# Altium schematic sheet ASIC_1.SchDoc: Title
size A2; Date: Date; CompanyName: Integrated Micro-Electronics Bulgaria; Organization: Design & Development Department; Address1: Drawing Type; Address2: Address 1; Address3: Address 2; Address4: Address 3; DocumentNumber: 730xxx; Revision: 01; SheetNumber: 1; SheetTotal: 1; PageSetup: Record=PageOptions|CenterHorizontal=True|CenterVertical=True|PrintScale=0.70|XCorrection=1.00|YCorrection=1.00|PrintKind=2|BorderSize=5000000|LeftOffset=0|BottomOffset=0|Orientation=2|PaperLength=1000|PaperWidth=1000|Scale=100|PaperSource=7|PrintQuality=-4|MediaType=1|DitherType=10|PaperKind=A4|PrintScaleMode=1; SheetSize: A3; Time: Time; ModifiedDate: Mod. Date
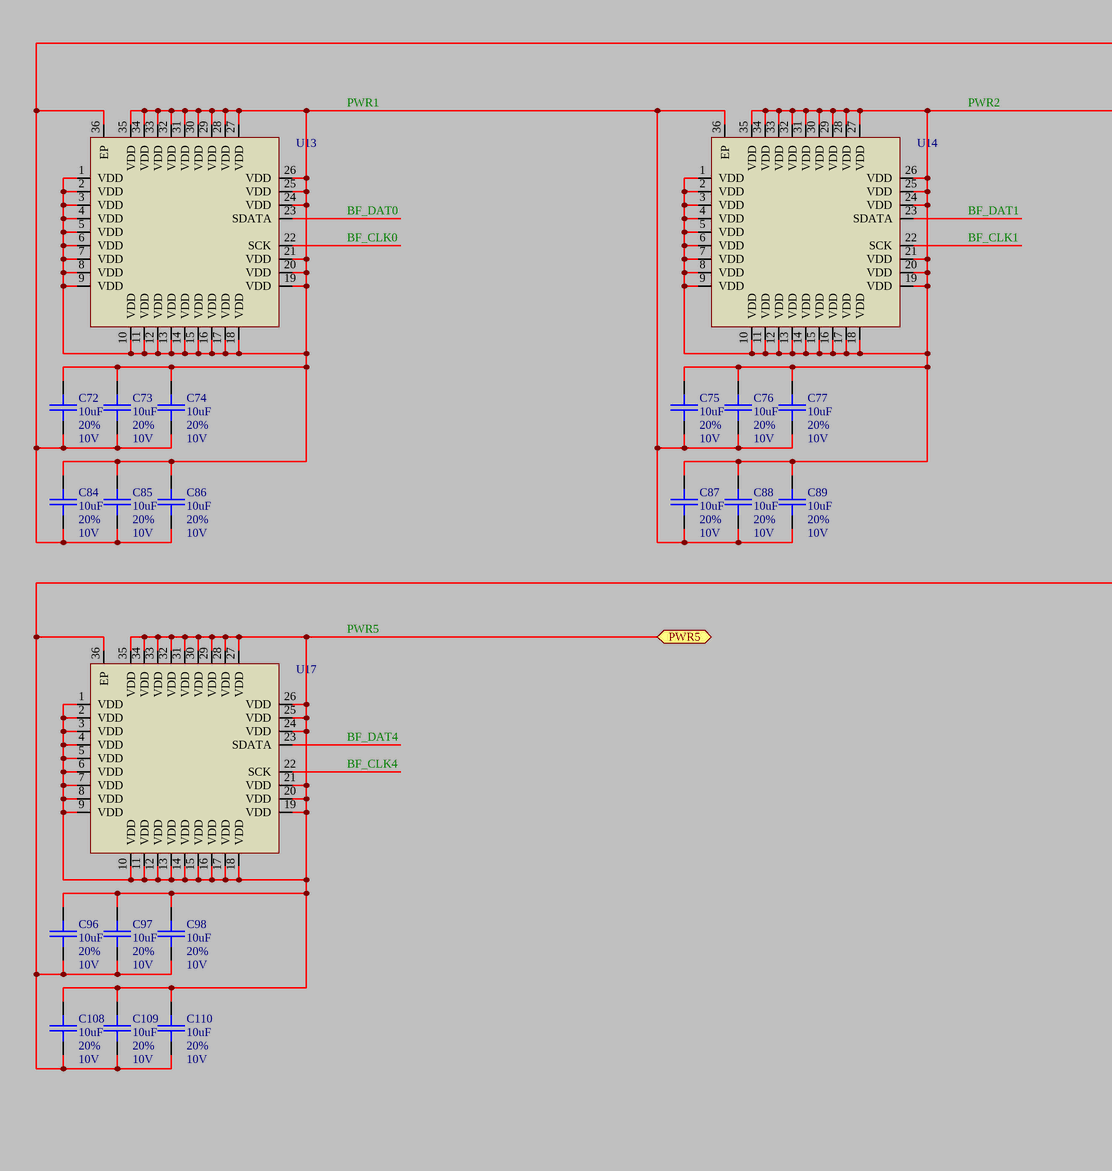
[diagram p0: ASIC_1.SchDoc, left]
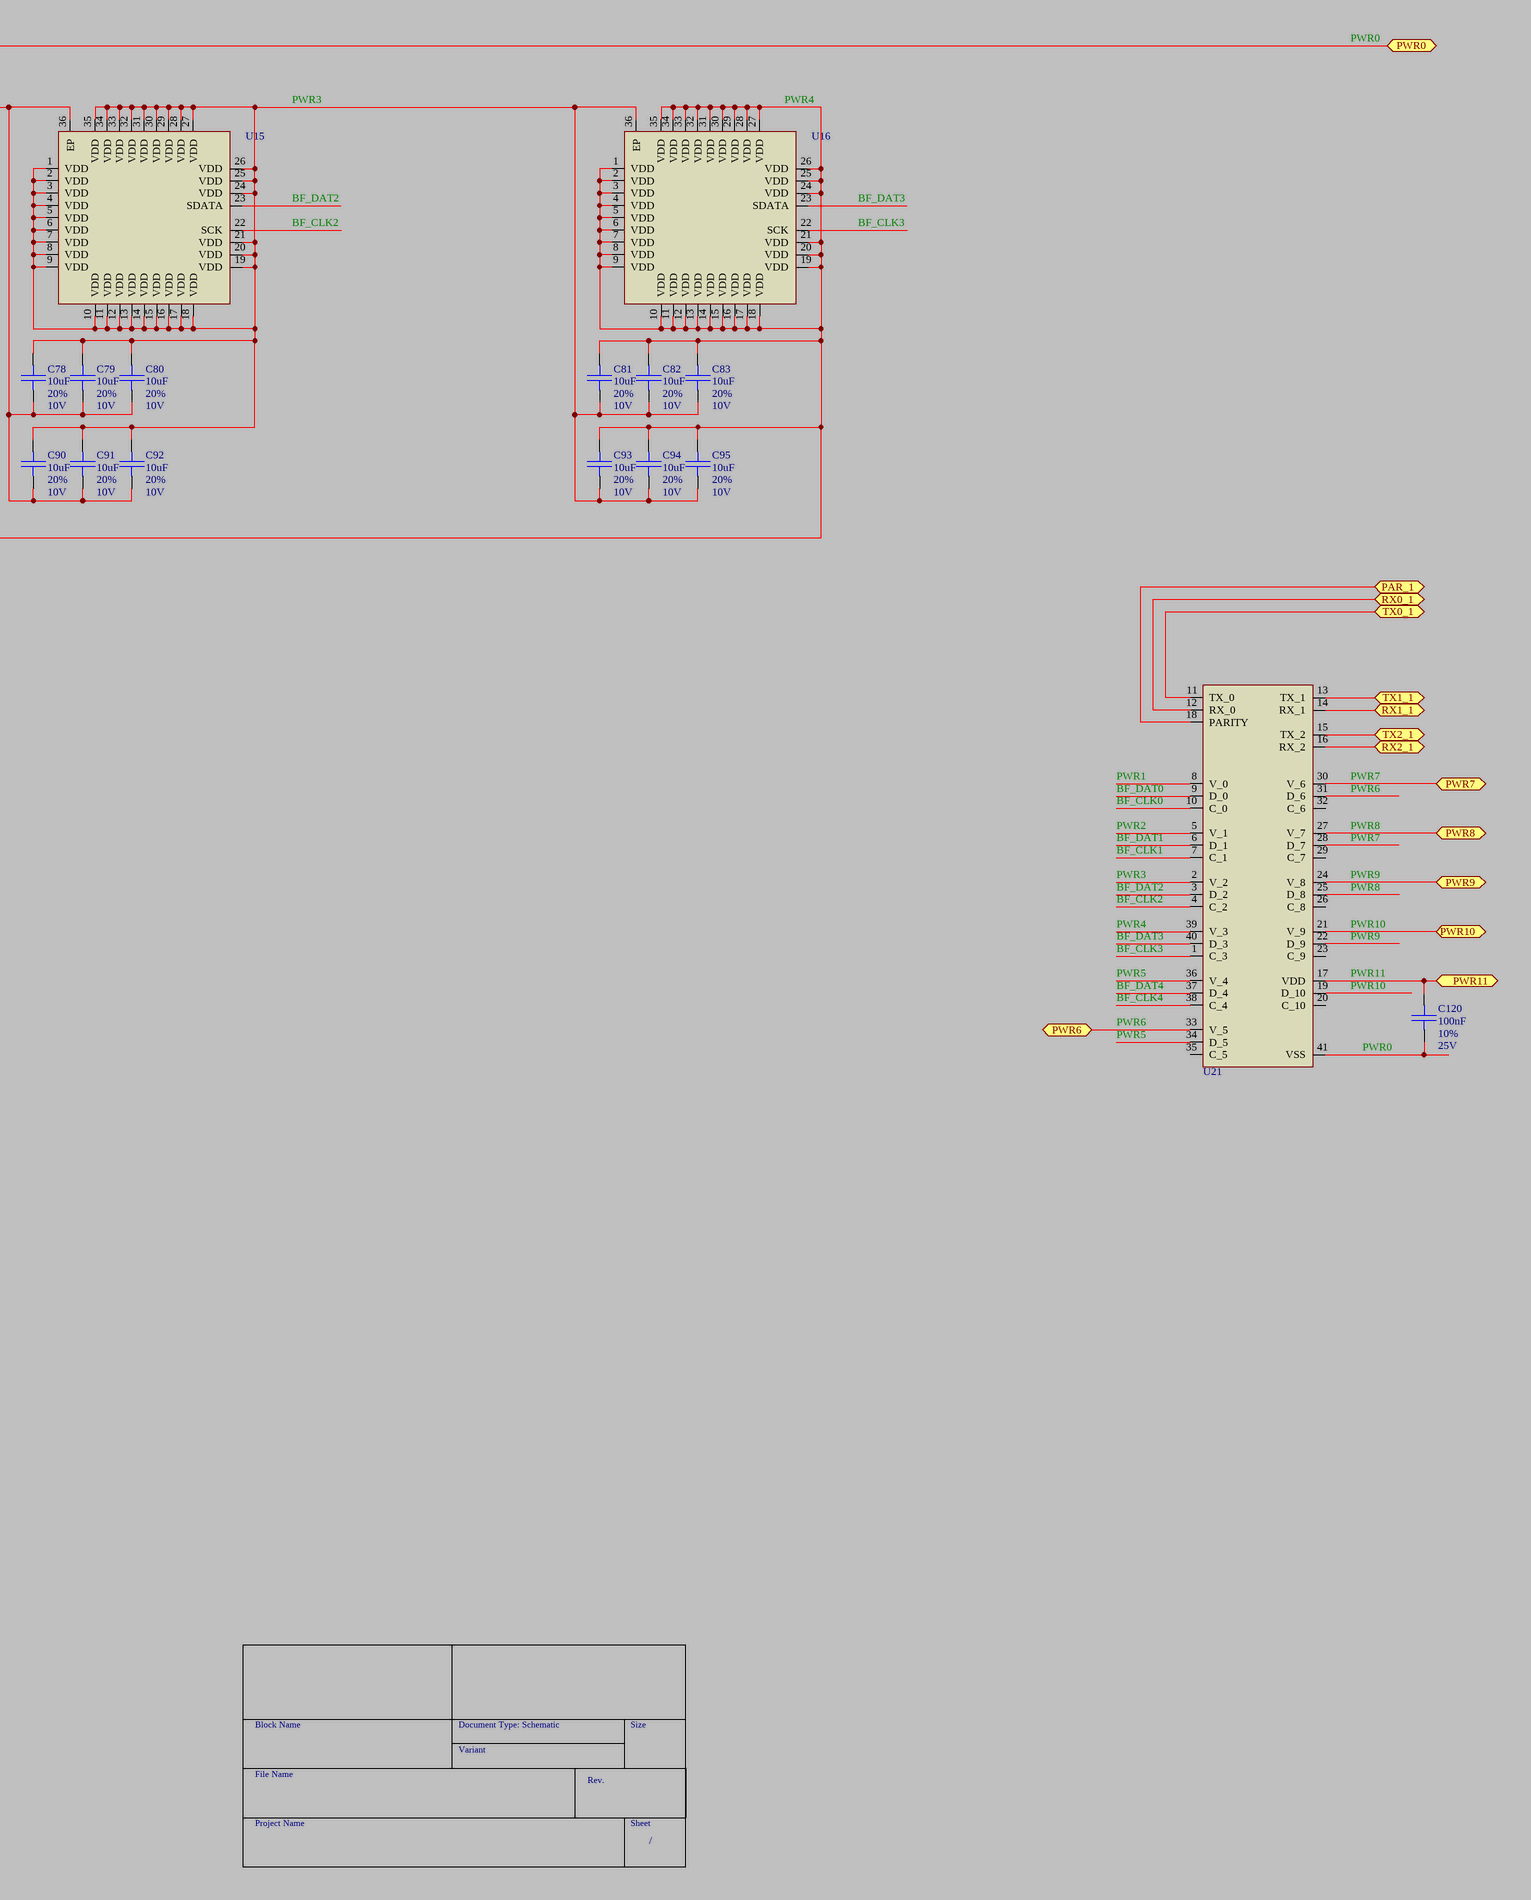
[diagram p1: ASIC_1.SchDoc, right]

## Parts
C72  DB_VALUE: 10uF  DB_TOLERANCE: 20%  DB_VOLTAGE: 10V  [SMD_0402_CAPC1005X70N]  (hidden comment: C)
C73  DB_VALUE: 10uF  DB_TOLERANCE: 20%  DB_VOLTAGE: 10V  [SMD_0402_CAPC1005X70N]  (hidden comment: C)
C74  DB_VALUE: 10uF  DB_TOLERANCE: 20%  DB_VOLTAGE: 10V  [SMD_0402_CAPC1005X70N]  (hidden comment: C)
C75  DB_VALUE: 10uF  DB_TOLERANCE: 20%  DB_VOLTAGE: 10V  [SMD_0402_CAPC1005X70N]  (hidden comment: C)
C76  DB_VALUE: 10uF  DB_TOLERANCE: 20%  DB_VOLTAGE: 10V  [SMD_0402_CAPC1005X70N]  (hidden comment: C)
C77  DB_VALUE: 10uF  DB_TOLERANCE: 20%  DB_VOLTAGE: 10V  [SMD_0402_CAPC1005X70N]  (hidden comment: C)
C78  DB_VALUE: 10uF  DB_TOLERANCE: 20%  DB_VOLTAGE: 10V  [SMD_0402_CAPC1005X70N]  (hidden comment: C)
C79  DB_VALUE: 10uF  DB_TOLERANCE: 20%  DB_VOLTAGE: 10V  [SMD_0402_CAPC1005X70N]  (hidden comment: C)
C80  DB_VALUE: 10uF  DB_TOLERANCE: 20%  DB_VOLTAGE: 10V  [SMD_0402_CAPC1005X70N]  (hidden comment: C)
C81  DB_VALUE: 10uF  DB_TOLERANCE: 20%  DB_VOLTAGE: 10V  [SMD_0402_CAPC1005X70N]  (hidden comment: C)
C82  DB_VALUE: 10uF  DB_TOLERANCE: 20%  DB_VOLTAGE: 10V  [SMD_0402_CAPC1005X70N]  (hidden comment: C)
C83  DB_VALUE: 10uF  DB_TOLERANCE: 20%  DB_VOLTAGE: 10V  [SMD_0402_CAPC1005X70N]  (hidden comment: C)
C84  DB_VALUE: 10uF  DB_TOLERANCE: 20%  DB_VOLTAGE: 10V  [SMD_0402_CAPC1005X70N]  (hidden comment: C)
C85  DB_VALUE: 10uF  DB_TOLERANCE: 20%  DB_VOLTAGE: 10V  [SMD_0402_CAPC1005X70N]  (hidden comment: C)
C86  DB_VALUE: 10uF  DB_TOLERANCE: 20%  DB_VOLTAGE: 10V  [SMD_0402_CAPC1005X70N]  (hidden comment: C)
C87  DB_VALUE: 10uF  DB_TOLERANCE: 20%  DB_VOLTAGE: 10V  [SMD_0402_CAPC1005X70N]  (hidden comment: C)
C88  DB_VALUE: 10uF  DB_TOLERANCE: 20%  DB_VOLTAGE: 10V  [SMD_0402_CAPC1005X70N]  (hidden comment: C)
C89  DB_VALUE: 10uF  DB_TOLERANCE: 20%  DB_VOLTAGE: 10V  [SMD_0402_CAPC1005X70N]  (hidden comment: C)
C90  DB_VALUE: 10uF  DB_TOLERANCE: 20%  DB_VOLTAGE: 10V  [SMD_0402_CAPC1005X70N]  (hidden comment: C)
C91  DB_VALUE: 10uF  DB_TOLERANCE: 20%  DB_VOLTAGE: 10V  [SMD_0402_CAPC1005X70N]  (hidden comment: C)
C92  DB_VALUE: 10uF  DB_TOLERANCE: 20%  DB_VOLTAGE: 10V  [SMD_0402_CAPC1005X70N]  (hidden comment: C)
C93  DB_VALUE: 10uF  DB_TOLERANCE: 20%  DB_VOLTAGE: 10V  [SMD_0402_CAPC1005X70N]  (hidden comment: C)
C94  DB_VALUE: 10uF  DB_TOLERANCE: 20%  DB_VOLTAGE: 10V  [SMD_0402_CAPC1005X70N]  (hidden comment: C)
C95  DB_VALUE: 10uF  DB_TOLERANCE: 20%  DB_VOLTAGE: 10V  [SMD_0402_CAPC1005X70N]  (hidden comment: C)
C96  DB_VALUE: 10uF  DB_TOLERANCE: 20%  DB_VOLTAGE: 10V  [SMD_0402_CAPC1005X70N]  (hidden comment: C)
C97  DB_VALUE: 10uF  DB_TOLERANCE: 20%  DB_VOLTAGE: 10V  [SMD_0402_CAPC1005X70N]  (hidden comment: C)
C98  DB_VALUE: 10uF  DB_TOLERANCE: 20%  DB_VOLTAGE: 10V  [SMD_0402_CAPC1005X70N]  (hidden comment: C)
C108  DB_VALUE: 10uF  DB_TOLERANCE: 20%  DB_VOLTAGE: 10V  [SMD_0402_CAPC1005X70N]  (hidden comment: C)
C109  DB_VALUE: 10uF  DB_TOLERANCE: 20%  DB_VOLTAGE: 10V  [SMD_0402_CAPC1005X70N]  (hidden comment: C)
C110  DB_VALUE: 10uF  DB_TOLERANCE: 20%  DB_VOLTAGE: 10V  [SMD_0402_CAPC1005X70N]  (hidden comment: C)
C120  DB_VALUE: 100nF  DB_TOLERANCE: 10%  DB_VOLTAGE: 25V  [SMD_0402_CAPC1005X55N]  (hidden comment: C)
U13  IC_BITFURY16  [SMD_QFN50P600X600X175-36AN]  (value not drawn)
U14  IC_BITFURY16  [SMD_QFN50P600X600X175-36AN]  (value not drawn)
U15  IC_BITFURY16  [SMD_QFN50P600X600X175-36AN]  (value not drawn)
U16  IC_BITFURY16  [SMD_QFN50P600X600X175-36AN]  (value not drawn)
U17  IC_BITFURY16  [SMD_QFN50P600X600X175-36AN]  (value not drawn)
U21  IC_BTC250  [SMD_QFN40P500X500X80-41N]  (value not drawn)

## Ports
PAR_1, PWR0, PWR5, PWR6, PWR7, PWR8, PWR9, PWR10, PWR11, RX0_1, RX1_1, RX2_1, TX0_1, TX1_1, TX2_1

## Nets
BF_CLK0: U13.22(SCK) U21.10(C_0)
BF_CLK1: U14.22(SCK) U21.7(C_1)
BF_CLK2: U15.22(SCK) U21.4(C_2)
BF_CLK3: U16.22(SCK) U21.1(C_3)
BF_CLK4: U17.22(SCK) U21.38(C_4)
BF_DAT0: U13.23(SDATA) U21.9(D_0)
BF_DAT1: U14.23(SDATA) U21.6(D_1)
BF_DAT2: U15.23(SDATA) U21.3(D_2)
BF_DAT3: U16.23(SDATA) U21.40(D_3)
BF_DAT4: U17.23(SDATA) U21.37(D_4)
PAR_1: U21.18(PARITY) ; port PAR_1
PWR0: C72.2 C73.2 C74.2 C84.2 C85.2 C86.2 C120.2 U13.36(EP) U21.41(VSS) ; port PWR0
PWR1: C72.1 C73.1 C74.1 C75.2 C76.2 C77.2 C84.1 C85.1 C86.1 C87.2 C88.2 C89.2 U13.1(VDD) U13.2(VDD) U13.3(VDD) U13.4(VDD) U13.5(VDD) U13.6(VDD) U13.7(VDD) U13.8(VDD) U13.9(VDD) U13.10(VDD) U13.11(VDD) U13.12(VDD) U13.13(VDD) U13.14(VDD) U13.15(VDD) U13.16(VDD) U13.17(VDD) U13.18(VDD) U13.19(VDD) U13.20(VDD) U13.21(VDD) U13.24(VDD) U13.25(VDD) U13.26(VDD) U13.27(VDD) U13.28(VDD) U13.29(VDD) U13.30(VDD) U13.31(VDD) U13.32(VDD) U13.33(VDD) U13.34(VDD) U13.35(VDD) U14.36(EP) U21.8(V_0)
PWR2: C75.1 C76.1 C77.1 C78.2 C79.2 C80.2 C87.1 C88.1 C89.1 C90.2 C91.2 C92.2 U14.1(VDD) U14.2(VDD) U14.3(VDD) U14.4(VDD) U14.5(VDD) U14.6(VDD) U14.7(VDD) U14.8(VDD) U14.9(VDD) U14.10(VDD) U14.11(VDD) U14.12(VDD) U14.13(VDD) U14.14(VDD) U14.15(VDD) U14.16(VDD) U14.17(VDD) U14.18(VDD) U14.19(VDD) U14.20(VDD) U14.21(VDD) U14.24(VDD) U14.25(VDD) U14.26(VDD) U14.27(VDD) U14.28(VDD) U14.29(VDD) U14.30(VDD) U14.31(VDD) U14.32(VDD) U14.33(VDD) U14.34(VDD) U14.35(VDD) U15.36(EP) U21.5(V_1)
PWR3: C78.1 C79.1 C80.1 C81.2 C82.2 C83.2 C90.1 C91.1 C92.1 C93.2 C94.2 C95.2 U15.1(VDD) U15.2(VDD) U15.3(VDD) U15.4(VDD) U15.5(VDD) U15.6(VDD) U15.7(VDD) U15.8(VDD) U15.9(VDD) U15.10(VDD) U15.11(VDD) U15.12(VDD) U15.13(VDD) U15.14(VDD) U15.15(VDD) U15.16(VDD) U15.17(VDD) U15.18(VDD) U15.19(VDD) U15.20(VDD) U15.21(VDD) U15.24(VDD) U15.25(VDD) U15.26(VDD) U15.27(VDD) U15.28(VDD) U15.29(VDD) U15.30(VDD) U15.31(VDD) U15.32(VDD) U15.33(VDD) U15.34(VDD) U15.35(VDD) U16.36(EP) U21.2(V_2)
PWR4: C81.1 C82.1 C83.1 C93.1 C94.1 C95.1 C96.2 C97.2 C98.2 C108.2 C109.2 C110.2 U16.1(VDD) U16.2(VDD) U16.3(VDD) U16.4(VDD) U16.5(VDD) U16.6(VDD) U16.7(VDD) U16.8(VDD) U16.9(VDD) U16.10(VDD) U16.11(VDD) U16.12(VDD) U16.13(VDD) U16.14(VDD) U16.15(VDD) U16.16(VDD) U16.17(VDD) U16.18(VDD) U16.19(VDD) U16.20(VDD) U16.21(VDD) U16.24(VDD) U16.25(VDD) U16.26(VDD) U16.27(VDD) U16.28(VDD) U16.29(VDD) U16.30(VDD) U16.31(VDD) U16.32(VDD) U16.33(VDD) U16.34(VDD) U16.35(VDD) U17.36(EP) U21.39(V_3)
PWR5: C96.1 C97.1 C98.1 C108.1 C109.1 C110.1 U17.1(VDD) U17.2(VDD) U17.3(VDD) U17.4(VDD) U17.5(VDD) U17.6(VDD) U17.7(VDD) U17.8(VDD) U17.9(VDD) U17.10(VDD) U17.11(VDD) U17.12(VDD) U17.13(VDD) U17.14(VDD) U17.15(VDD) U17.16(VDD) U17.17(VDD) U17.18(VDD) U17.19(VDD) U17.20(VDD) U17.21(VDD) U17.24(VDD) U17.25(VDD) U17.26(VDD) U17.27(VDD) U17.28(VDD) U17.29(VDD) U17.30(VDD) U17.31(VDD) U17.32(VDD) U17.33(VDD) U17.34(VDD) U17.35(VDD) U21.34(D_5) U21.36(V_4) ; port PWR5
PWR6: U21.31(D_6) U21.33(V_5) ; port PWR6
PWR7: U21.28(D_7) U21.30(V_6) ; port PWR7
PWR8: U21.25(D_8) U21.27(V_7) ; port PWR8
PWR9: U21.22(D_9) U21.24(V_8) ; port PWR9
PWR10: U21.19(D_10) U21.21(V_9) ; port PWR10
PWR11: C120.1 U21.17(VDD) ; port PWR11
RX0_1: U21.12(RX_0) ; port RX0_1
RX1_1: U21.14(RX_1) ; port RX1_1
RX2_1: U21.16(RX_2) ; port RX2_1
TX0_1: U21.11(TX_0) ; port TX0_1
TX1_1: U21.13(TX_1) ; port TX1_1
TX2_1: U21.15(TX_2) ; port TX2_1

Not connected (* = marked no-connect by the designer): U21 20(C_10) 23(C_9) 26(C_8) 29(C_7) 32(C_6) 35(C_5)

## Notes on the sheet
- Block Name
- Document Type: Schematic
- Size
- File Name
- Variant
- Rev.
- Project Name
- Sheet
- /

## Library data of the parts
C72-C98 C108-C110 = CAP000047481: DB_PART_TYPE: Ceramic_SMD\Standard_X5R; DB_MANUFACTURER_PART: SAMSUNG    CL05A106MP5NUNC; NOTE: <NOTE>; DB_T_RANGE: -55 to 85; DB_PACKAGE: 0402; DB_DESCRIPTION: C X5R 10uF 20% 10V 0402; DB_APPROVED_BY: VSN; DB_STATUS: NEW; DB_PART_NUMBER: CAP000047481; DB_PCB_DEVICE: SMD_0402_CAPC1005X70N; DB_APPROVED_ON: 20.04.2016 14:32:27; DB_DATASHEET: http://john.epiqdesign.com/projects/CIS_Datasheets/CAP_S_CL05A106MP5NUNC.pdf?rev=2053&sc=0
C120 = CAP000047469: DB_PART_TYPE: Ceramic_SMD\Standard_X5R; DB_MANUFACTURER_PART: SAMSUNG    CL05A104KA5NNNC; NOTE: <NOTE>; DB_T_RANGE: -55 to 85; DB_PACKAGE: 0402; DB_DESCRIPTION: C X5R 100nF 10% 25V 0402; DB_APPROVED_BY: VSN; DB_STATUS: NEW; DB_PART_NUMBER: CAP000047469; DB_PCB_DEVICE: SMD_0402_CAPC1005X55N; DB_APPROVED_ON: 08.03.2016 08:26:43; DB_DATASHEET: http://john.epiqdesign.com/projects/CIS_Datasheets/CAP_CL05A104KA5NNNC_100nF_X5R_25V_10_0402_Samsung.pdf?rev=1997&sc=0
U13-U17 = IC_BITFURY16: BitFury 2016 16 nm; DB_PCB_DEVICE: SMD_QFN50P600X600X175-36AN
U21 = IC_BTC250: DB_PCB_DEVICE: SMD_QFN40P500X500X80-41N